# Altium schematic sheet ButtonAndSwitches.SchDoc
size A
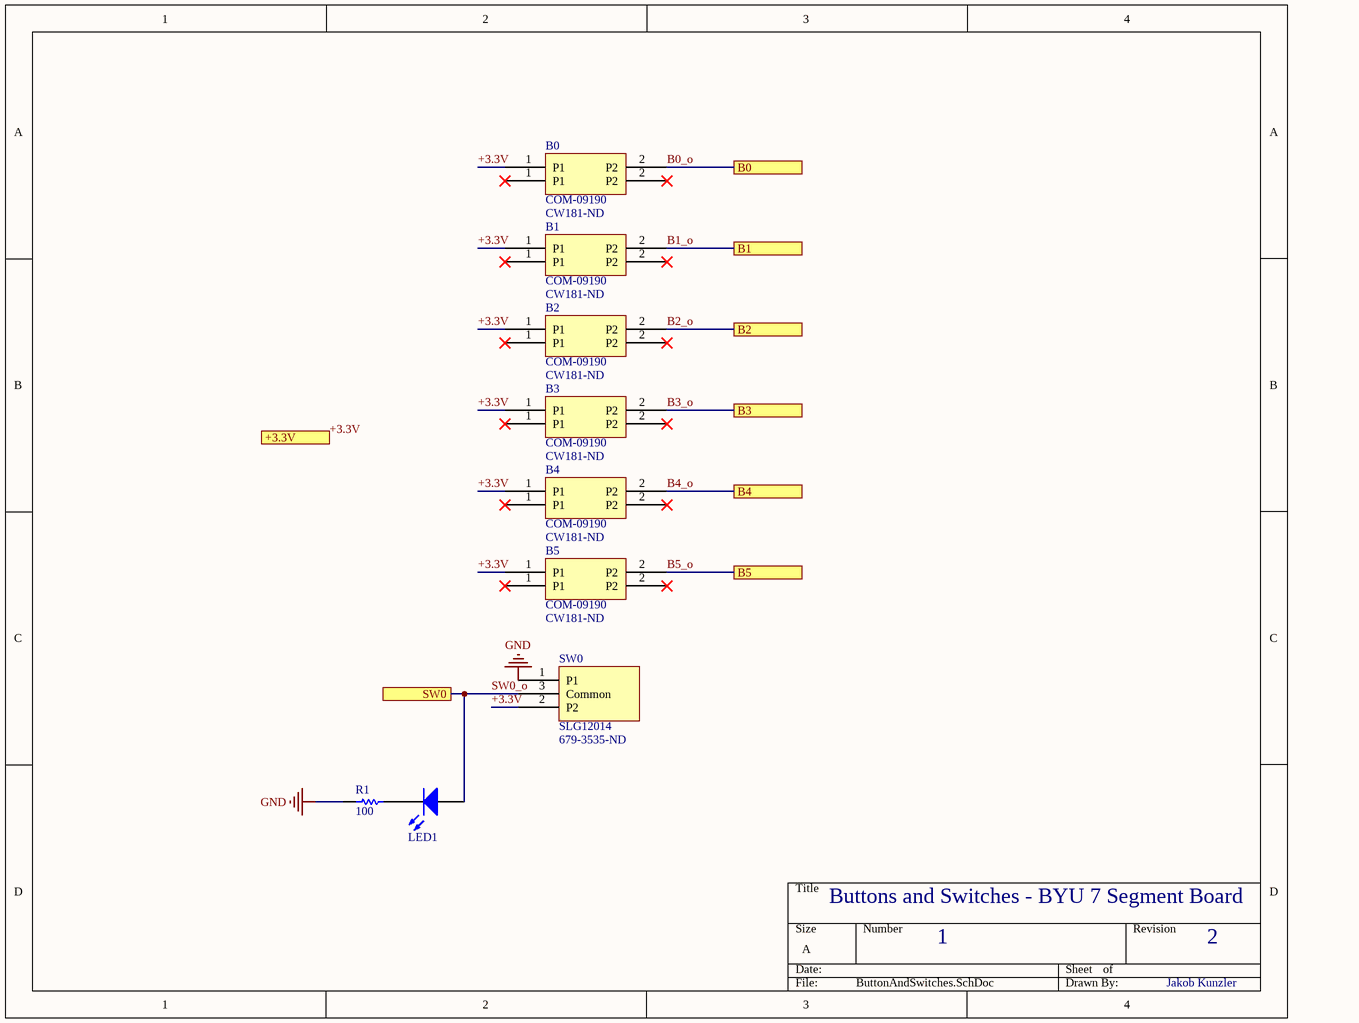
[diagram p0: ButtonAndSwitches.SchDoc]

## Parts
B0  COM-09190  Supplier Part Number 1: CW181-ND  [COM-09190]
B1  COM-09190  Supplier Part Number 1: CW181-ND  [COM-09190]
B2  COM-09190  Supplier Part Number 1: CW181-ND  [COM-09190]
B3  COM-09190  Supplier Part Number 1: CW181-ND  [COM-09190]
B4  COM-09190  Supplier Part Number 1: CW181-ND  [COM-09190]
B5  COM-09190  Supplier Part Number 1: CW181-ND  [COM-09190]
LED1  LTL-4223  [LED Through]  (value not drawn)
R1  100  [Resistor Through Hole]
SW0  SLG12014  Supplier Part Number 1: 679-3535-ND  [SLG12014]

## Ports
+3.3V, B0, B1, B2, B3, B4, B5, SW0

## Nets
GND: R1.2 SW0.1(P1)
+3.3V: B0.1(P1) B1.1(P1) B2.1(P1) B3.1(P1) B4.1(P1) B5.1(P1) SW0.2(P2) ; port +3.3V
B0_o: B0.2(P2) ; port B0
B1_o: B1.2(P2) ; port B1
B2_o: B2.2(P2) ; port B2
B3_o: B3.2(P2) ; port B3
B4_o: B4.2(P2) ; port B4
B5_o: B5.2(P2) ; port B5
SW0_o: LED1.1(A) SW0.3(Common) ; port SW0
NetLED1_2: LED1.2(K) R1.1

## Notes on the sheet
- Buttons and Switches - BYU 7 Segment Board
- 1
- 2
- Jakob Kunzler

## Library data of the parts
B0-B5 = Push Button_Tactile: Momentary Pushbutton Switch - 12mm Square; Supplier 1: Digi-Key; ComponentLink2Description: Momentary Pushbutton Switch - 12mm Square; ComponentLink2URL: https://www.sparkfun.com/products/9190
LED1 = LED_RED: 2 V drop 10 mA Red; ComponentLink1Description: 160-1127-ND; ComponentLink1URL: https://www.digikey.com/product-detail/en/lite-on-inc/LTL-4223/160-1127-ND/200395; Supplier 1: Digi-Key
R1 = Resistor_100: CF14JT100R; ComponentLink1Description: CF14JT100RCT-ND; ComponentLink1URL: https://www.digikey.com/product-detail/en/stackpole-electronics-inc/CF14JT100R/CF14JT100RCT-ND/1830327; Supplier 1: Digi-Key
SW0 = SlideSwitch: SWITCH SLIDE SPDT 300MA 125V; ComponentLink1Description: 679-3535-ND; ComponentLink1URL: https://www.digikey.com/product-detail/en/apem-inc/SLG12014/679-3535-ND/1797348; Supplier 1: Digi-Key